# EAGLE schematic GDEnvSensorGW_1_15 (EAGLE 9.4.0)
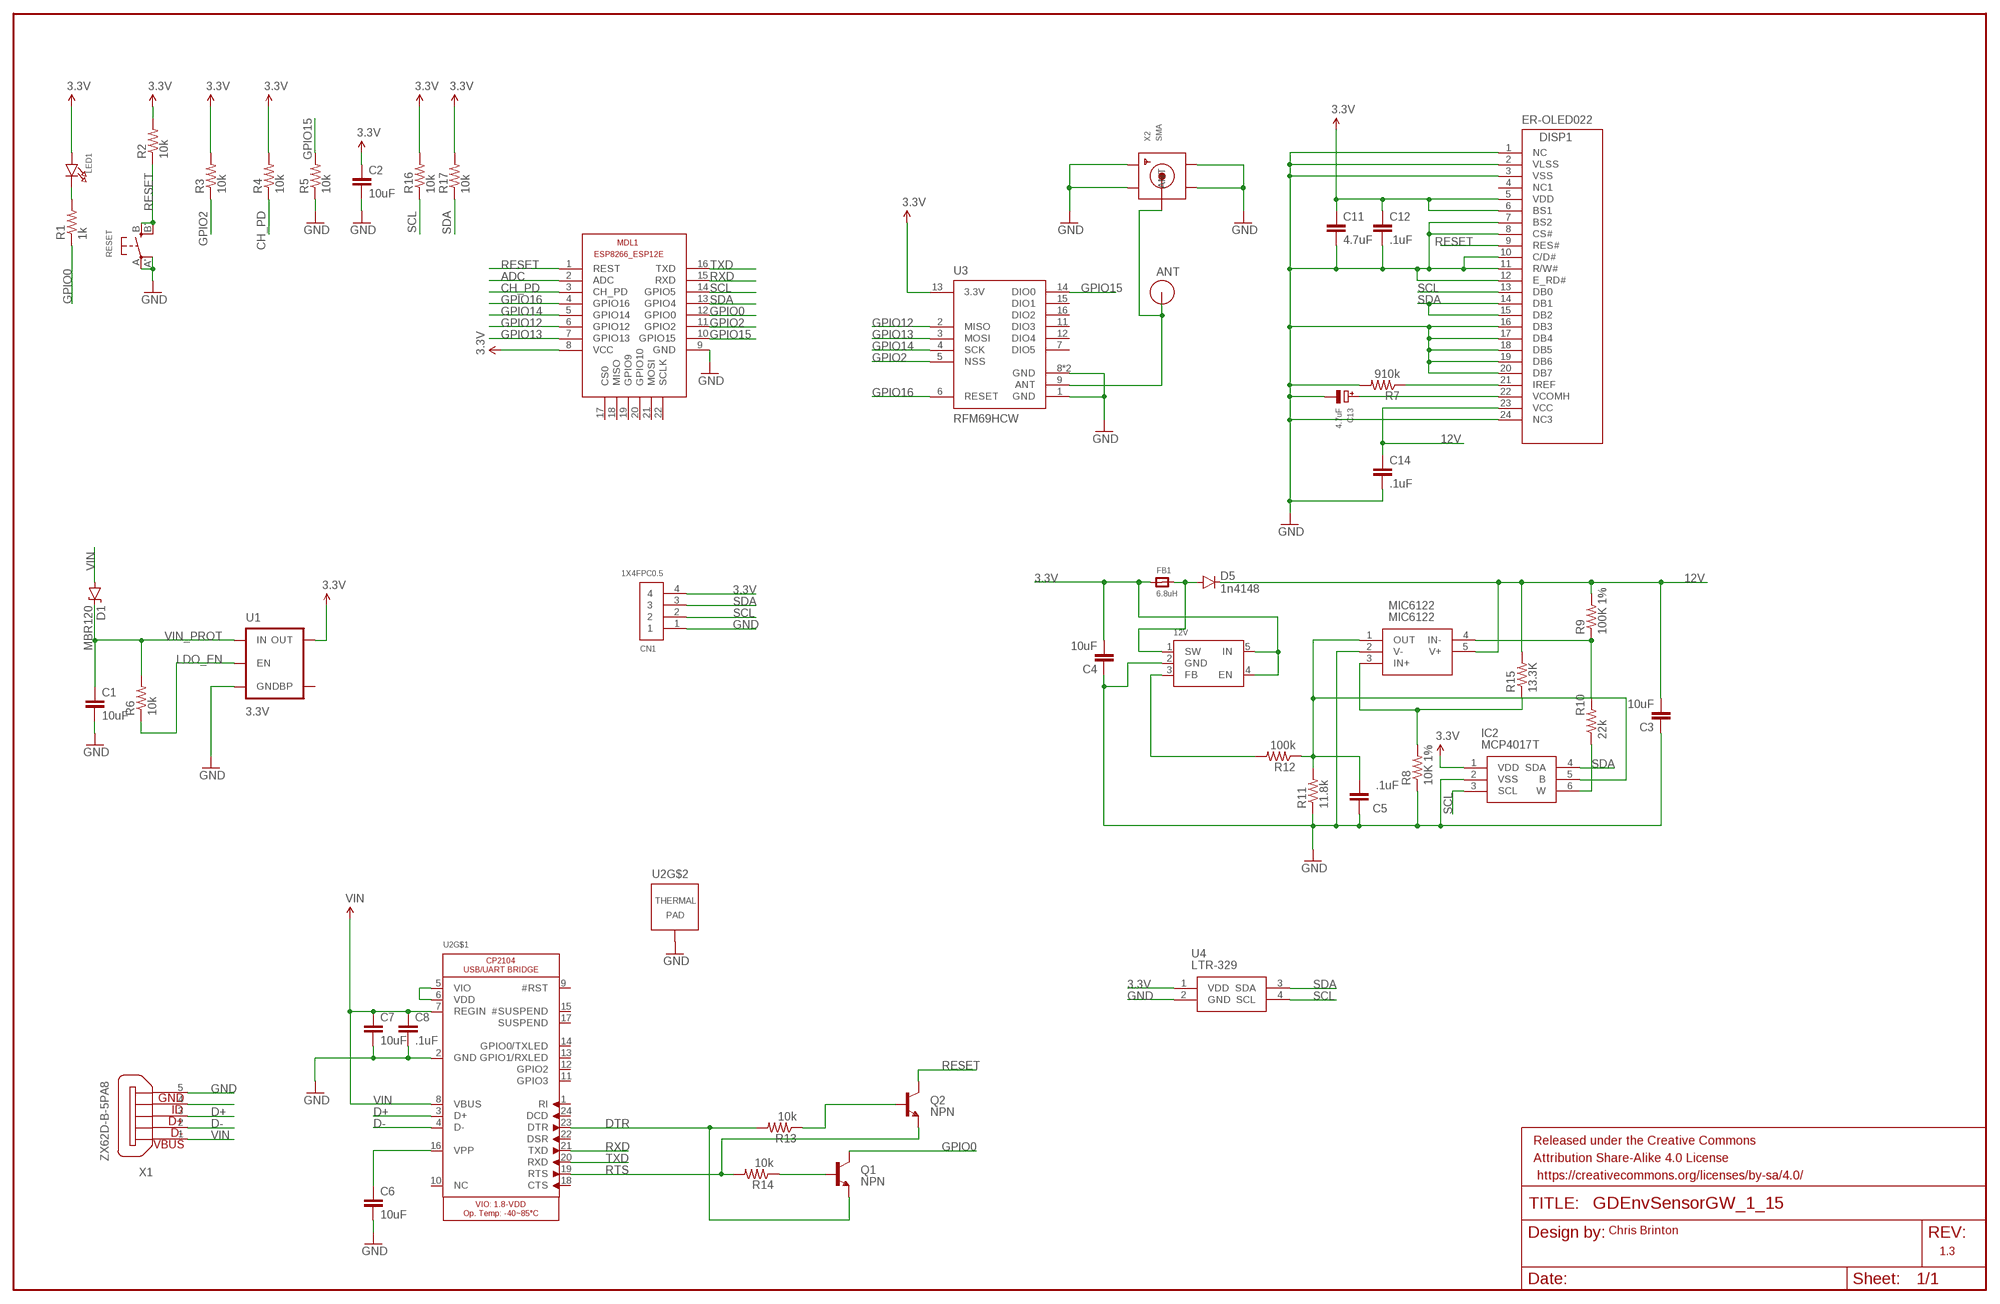
[diagram p0: schematic, sheet 1]

## Parts
12V  MP1541_SOT23-5  [SOT23-5]
ANT  RFM12B_ANTENNA  [RFM12B-ANTENNA]
C1  10uF  10UF10V10%(0805)  [0805-CAP]
C2  10uF  10UF10V10%(0805)  [0805-CAP]
C3  10uF  10UF10V10%(0805)  [0805-CAP]
C4  10uF  10UF10V10%(0805)  [0805-CAP]
C5  .1uF  10UF10V10%(0805)  [0805-CAP]
C6  10uF  10UF10V10%(0805)  [0805-CAP]
C7  10uF  10UF10V10%(0805)  [0805-CAP]
C8  .1uF  10UF10V10%(0805)  [0805-CAP]
C11  4.7uF  10UF10V10%(0805)  [0805-CAP]
C12  .1uF  10UF10V10%(0805)  [0805-CAP]
C13  4.7uF  CAP_TANTALUMA/3216_REFLOW  [EIA3216-18/A-R]
C14  .1uF  10UF10V10%(0805)  [0805-CAP]
CN1  1X4FPC0.5  [FPC_0.5MM-4]
D1  MBR120  DIODE-ZENER16V  [SOD-123]
D5  1n4148  DIODEBAS16  [SOD-323]
DISP1  ER-OLED022  [ER-OLED022]
FB1  6.8uH  FERRITE_0805  [_0805]
FRAME1  FRAME-LEDGER  [CREATIVE_COMMONS]
IC2  MCP4017T  MCP4017T-503E_LT  [SOT65P210X110-6N]
LED1  LED0805  [CHIPLED_0805]
MDL1  ESP8266-ESP12F  ESP8266-12EESP8266-ESP12E  [ESP8266-ESP12E]
MIC6122  MIC6122  MIC6211YM5-TR  [SOT95P280X145-5N]
Q1  NPN  TRANSISTOR_NPNMMBT2222A  [SOT23-3]
Q2  NPN  TRANSISTOR_NPNMMBT2222A  [SOT23-3]
R1  1k  R-US_R0805  [R0805]
R2  10k  R-US_R0805  [R0805]
R3  10k  R-US_R0805  [R0805]
R4  10k  R-US_R0805  [R0805]
R5  10k  R-US_R0805  [R0805]
R6  10k  R-US_R0805  [R0805]
R7  910k  R-US_R0805  [R0805]
R8  10K 1%  R-US_R0805  [R0805]
R9  100K 1%  R-US_R0805  [R0805]
R10  22k  R-US_R0805  [R0805]
R11  11.8k  R-US_R0805  [R0805]
R12  100k  R-US_R0805  [R0805]
R13  10k  R-US_R0805  [R0805]
R14  10k  R-US_R0805  [R0805]
R15  13.3K  R-US_R0805  [R0805]
R16  10k  R-US_R0805  [R0805]
R17  10k  R-US_R0805  [R0805]
RESET  SWITCH_TACT_SMT4.6X2.8  [BTN_KMR2_4.6X2.8]
U1  3.3V  V_REG_MIC52193.3V  [SOT23-5]
U2  CP2104  [QFN24_4MM_SMSC]
U3  RFM69HCW  [RFM69HCW-XXXS2]
U4  LTR-329  LTR-329ALS-01  [LTR329ALS01]
X1  ZX62D-B-5PA8  [ZX62D-B-5PA8]
X2  SMA  SMACONNECTOR_EDGE_UFL  [SMA_EDGELAUNCH_UFL]

## Nets
3.3V: 12V.4(EN) 12V.5(IN) C2.1 C4.2 C11.1 C12.1 CN1.4 DISP1.5(VDD) DISP1.6(BS1) FB1.1 IC2.1(VDD) LED1.A MDL1.8(VCC) R2.2 R3.2 R4.2 R16.2 R17.2 U1.5(OUT) U3.13(3.3V) U4.1(VDD)
12V: C3.2 C14.1 D5.C DISP1.23(VCC) MIC6122.5(V+) R9.2 R15.2
ADC: MDL1.2(ADC)
ANT: ANT.P$1 U3.9(ANT) X2.P(ANT)
CH_PD: MDL1.3(CH_PD) R4.1
D+: U2.3(D+) X1.3
D-: U2.4(D-) X1.2
DTR: Q1.2(E) R13.2 U2.23(DTR)
GND: 12V.2(GND) C1.2 C2.2 C3.1 C4.1 C5.1 C6.2 C7.2 C8.2 C11.2 C12.2 C13.- C14.2 CN1.1 DISP1.1(NC) DISP1.2(VLSS) DISP1.3(VSS) DISP1.7(BS2) DISP1.8(CS#) DISP1.10(C/D#) DISP1.11(R/W#) DISP1.12(E_RD#) DISP1.16(DB3) DISP1.17(DB4) DISP1.18(DB5) DISP1.19(DB6) DISP1.20(DB7) DISP1.24(NC3) IC2.2(VSS) MDL1.9(GND) MIC6122.2(V-) R5.1 R7.2 R8.1 R11.1 RESET.A'(P1) RESET.A(P) U1.2(GND) U2.2(GND) U2.THERM(TP) U3.1(GND) U3.8(GND) U3.10(GND) U4.2(GND) X1.5 X2.GND@1(GND1) X2.GND@2(GND2) X2.GND@3(GND3) X2.GND@4(GND4)
GPIO0: MDL1.12(GPIO0) Q1.3(C) R1.1
GPIO2: MDL1.11(GPIO2) R3.1 U3.5(NSS)
GPIO12: MDL1.6(GPIO12) U3.2(MISO)
GPIO13: MDL1.7(GPIO13) U3.3(MOSI)
GPIO14: MDL1.5(GPIO14) U3.4(SCK)
GPIO15: MDL1.10(GPIO15) R5.2 U3.14(DIO0)
GPIO16: MDL1.4(GPIO16) U3.6(RESET)
LDO_EN: R6.1 U1.3(EN)
N$1: U2.5(VIO) U2.6(VDD)
N$2: MIC6122.3(IN+) R8.2 R15.1
N$3: LED1.C R1.2
N$4: C13.+ DISP1.22(VCOMH)
N$5: C6.1 U2.16(VPP)
N$6: C5.2 IC2.5(B) MIC6122.1(OUT) R11.2 R12.1
N$7: MIC6122.4(IN-) R9.1 R10.2
N$8: 12V.1(SW) D5.A FB1.2
N$9: Q2.1(B) R13.1
N$11: DISP1.21(IREF) R7.1
N$12: IC2.6(W) R10.1
N$15: 12V.3(FB) R12.2
N$16: X1.4
N$17: Q1.1(B) R14.1
RESET: DISP1.9(RES#) MDL1.1(REST) Q2.3(C) R2.1 RESET.B'(S1) RESET.B(S)
RTS: Q2.2(E) R14.2 U2.19(RTS)
RXD: MDL1.15(RXD) U2.21(TXD)
SCL: CN1.2 DISP1.13(DB0) IC2.3(SCL) MDL1.14(GPIO5) R16.1 U4.4(SCL)
SDA: CN1.3 DISP1.14(DB1) DISP1.15(DB2) IC2.4(SDA) MDL1.13(GPIO4) R17.1 U4.3(SDA)
TXD: MDL1.16(TXD) U2.20(RXD)
VIN: C7.1 C8.1 D1.A U2.7(REGIN) U2.8(VBUS) X1.1
VIN_PROT: C1.1 D1.C R6.2 U1.1(IN)
Unconnected: DISP1.4(NC1) MDL1.17(CS0) MDL1.18(MISO) MDL1.19(GPIO9) MDL1.20(GPIO10) MDL1.21(MOSI) MDL1.22(SCLK) U1.4(BP) U2.1(RI) U2.9(#RST) U2.10(NC) U2.11(GPIO3) U2.12(GPIO2) U2.13(GPIO1/RXLED) U2.14(GPIO0/TXLED) U2.15(#SUSPEND) U2.17(SUSPEND) U2.18(CTS) U2.22(DSR) U2.24(DCD) U3.7(DIO5) U3.11(DIO3) U3.12(DIO4) U3.15(DIO1) U3.16(DIO2) X1.S1 X1.S2 X1.S3 X1.S4

## Notes on the sheet
- Chris Brinton
- 1.3

## Library data of the parts
12V = GDTech:MP1541_SOT23-5: SOT23-5 MP1541 Voltage Boost The MP1541 is a 5-pin thin SOT23 current mode step up converter intended for small, low power applications
ANT = LowPowerLab:RFM12B_ANTENNA; LABEL: ANT
C1-C8 C11 C12 C14 = SparkFun-Capacitors:10UF10V10%(0805): CAP-11330; PROD_ID: CAP-11330
C13 = microbuilder:CAP_TANTALUM: Tantalum Capacitors Wave footprints have larger pads and are meant to be used for hand soldering. Reflow footprints are optimised for solder paste and a reflow oven. EIA3216-18/A-[R/W] - Size A / 3216-18 / 1206 footprint 4.7µF 25V 10% Tantalum Capacitor 10µF 16V 10% Tantalum Capacitor [Digikey: 495-2236-2-ND] EIA3528-21/B-[R/W] - Size B / 3528-21 47µF 10V 10% Tantalum Capactior [Digikey: 495-2216-1-ND] EIA6032-28/C-[R/W] - Size C / 6032-28 10µF 35V 20% Tantalum Capacitor [Digikey: 495-2285-1-ND] 100µF 16V 10% Tantalum Capactior [Digikey: 399-5214-1-ND]
CN1 = adafruit:1X4: 4-pin connector
D1 = SparkFun-DiscreteSemi:DIODE-ZENER: Zener Diode Production Part - 8199 3.4V Zener Voltage; PROD_ID: DIO-12440; VALUE: 16V
D5 = SparkFun-DiscreteSemi:DIODE: Diode These are standard reverse protection diodes and small signal diodes. SMA package can handle up to about 1A. SOD-323 can handle about 200mA. What the SOD-323 package when ordering, there are some mfgs out there that are 5-pin packages.; PROD_ID: DIO-09646; VALUE: 250mA/100V
DISP1 = GDTech:ER-OLED022: East Rising 2.2" OLED display 128x32 24 pin .5mm pitch FPC connector
FB1 = microbuilder:FERRITE: Ferrite Bead 0603 MMZ1608B121C - 120 Ohm @ 100MHz, 600mA, 0.15 Ohm DC Resistance - Digikey: 445-2164-1-ND BK1608HW121-T - 120 Ohm, 600mA Ferrite Chip - Digikey: 587-1876-2-ND 0805 HZ0805B272R-10 - 2.7K Ohm @ 100MHz, 200mA, 0.8 Ohm DC Resistance - Digikey: 240-2504-1-ND (see also Murata BLM21BD272SN1L) MMZ2012Y152B - 1.5K Ohm @ 100MHz, 500mA, 0.4 Ohm DC Resistance - Digikey: 445-1560-1-ND - Mainly for high frequency (80-400MHz) MMZ2012R102A - 1K Ohm @ 100MHz, 500mA, 0.3 Ohm DC Resistance - Digikey: 445-1555-2-ND - More general purpose (10-200MHz)
FRAME1 = SparkFun-Aesthetics:FRAME-LEDGER: Schematic Frame Standard 11x14 US Ledger frame
IC2 = SamacSys_Parts:MCP4017T-503E_LT: Digital POT Source: Datasheet <http://componentsearchengine.com/Datasheets/3/MCP4017T-503E_LT.pdf>; ALLIED_NUMBER: 70388684; ALLIED_PRICE-STOCK: https://www.alliedelec.com/microchip-technology-inc-mcp4017t-503e-lt/70388684/; DESCRIPTION: Digital POT; HEIGHT: mm; MANUFACTURER_NAME: Microchip; MANUFACTURER_PART_NUMBER: MCP4017T-503E/LT; MOUSER_PART_NUMBER: 579-MCP4017T503E/LT; MOUSER_PRICE-STOCK: https://www.mouser.com/Search/Refine.aspx?Keyword=579-MCP4017T503E%2FLT; RS_PART_NUMBER: 7386796P; RS_PRICE-STOCK: http://uk.rs-online.com/web/p/products/7386796P
LED1 = microbuilder:LED: LED 0603 - 0603 Surface Mount Package 2mA: Green LED - Low Power (3.9mcd, 2ma, 1.7Vf) - Digikey: 475-2709-2-ND Orange LED - Low Power (9.8mcd, 2ma, 1.8Vf) - Digikey: 475-1194-2-ND Red LED - Low Power (5mcd, 2ma, 1.8Vf) - Digikey: 475-1195-2-ND Yellow LED - Low Power (7mcd, 2ma, 1.8Vf) - Digikey: 475-1196-2-ND 5mA: Blue LED - Low Power (17mcd, 5ma, 2.9Vf) - Digikey: LNJ937W8CRACT-ND 0805 - 0805 Surface Mount Package 2mA: Red LED (8.8mcd, 2mA, 1.8Vf, Clear) - Low Power [Digikey: 475-2510-1-ND] Green LED (5mcd, 2mA, 1.8Vf, Clear) - Low Power [Digikey: 475-2730-1-ND] Yellow LED (11.3mcd, 2mA, 1.8Vf, Clear) - Low Power [Digikey: 475-2555-1-ND] 20mA: Red LED (104mcd, 20mA, Diffused) - LS R976 [Digikey: 475-1278-6-ND] Red LED (12mcd, 20mA, 2.0Vf, Clear) - APT2012EC [Digikey: 754-1128-1-ND] Green LED (15mcd, 20mA, 2.2Vf, Clear) - APT2012GC [Digikey: 754-1131-1-ND] Orange LED (160mcd, 20mA, 2.1Vf, Clear) - APT2012SECK [Digikey: 754-1130-1-ND] 1206 - 1206 Surface Mount Package Green LED (26mcd, 20mA, Diffused) - LG N971 [Digikey: 475-1407-6-ND] Red LED (15mcd, 20mA, Diffused) - LH N974 [Digikey: 475-1416-6-ND]
MDL1 = ESP12E:ESP8266-12E: ESP8266-12E with additional I/O and GPIO04/05 corrected The author cannot warrant that this library is free from error or will meet your specific requirements. Created by PuceBaboon.com. Komagane, Nagano, JAPAN
MIC6122 = SamacSys_Parts:MIC6211YM5-TR: Operational Amplifiers - Op Amps Source: Datasheet <http://ww1.microchip.com/downloads/en/DeviceDoc/mic6211.pdf>; DESCRIPTION: Operational Amplifiers - Op Amps; HEIGHT: 1.45mm; MANUFACTURER_NAME: Micrel; MANUFACTURER_PART_NUMBER: MIC6211YM5-TR; MOUSER_PART_NUMBER: 998-MIC6211YM5TR; MOUSER_PRICE-STOCK: https://www.mouser.com/Search/Refine.aspx?Keyword=998-MIC6211YM5TR
Q1 Q2 = SparkFun-DiscreteSemi:TRANSISTOR_NPN: Generic NPN BJT MMBT2222A - TRANS-08049 (SOT-23, 1A 40V) MPSA42 - TRANS-09116 (SOT-23, 500mA 300V) MMBT5088LT1G - TRANS-11160 (SOT-23, 50 mA 30V) BC547 - COM-08928 <http://www.sparkfun.com/products/8928> (TO-92 45V 100mA) (1.Collector 2.Base 3.Emitter) 2N3904 - COM-00521 <http://www.sparkfun.com/products/521> (TO-92 40V 200mA) (1.Emitter 2.Base 3.Collector) P2N2222A - COM-12852 <http://www.sparkfun.com/products/12852> (TO-92 40V 600mA) (1.Collector 2.Base 3.Emitter); PROD_ID: TRANS-08049; VALUE: MMBT2222A
R1-R17 = adafruit:R-US_: RESISTOR, American symbol
RESET = microbuilder:SWITCH_TACT_SMT: SMT Tact Switches 6x6mm - Digikey: P12940SCT-ND KMR2 (4.6x2.8mm) - Digikey: 401-1426-1-ND EVQ-PQHB55 - Light Touch, 160GF (4.5x4.5mm) - Digikey: P8090SCT-ND
U1 = SparkFun-PowerIC:V_REG_MIC5219: V_REG MIC5219 Standard 3.3V and 5V 500mA LDO voltage regulator in SOT-23 layout. Micrel part MIC5219. BP (by-pass) pin is used to lower output noise with 470pF cap, may be left open.; PROD_ID: VREG-09872; VALUE: MIC5219 3.3V
U2 = GDTech:CP2104: CP2104 - USB to UART Bridge VDD Output: 3.45V
U3 = SparkFun-RF:RFM69H; PROD_ID: IC-11997, IC-12053
U4 = SamacSys_Parts:LTR-329ALS-01: Ambient Light Sensors Ambient Light Photo Sensor Source: Datasheet <http://www.mouser.com/ds/2/239/liteon_LTR-329ALS-01-1175539.pdf>; DESCRIPTION: Ambient Light Sensors Ambient Light Photo Sensor; HEIGHT: 0mm; MANUFACTURER_NAME: Lite-On; MANUFACTURER_PART_NUMBER: LTR-329ALS-01; MOUSER_PART_NUMBER: 859-LTR-329ALS-01; MOUSER_PRICE-STOCK: https://www.mouser.com/Search/Refine.aspx?Keyword=859-LTR-329ALS-01
X1 = GDTech:ZX62D-B-5PA8: Micro USB Type B Connector - Standard, Shell Through Hole Source: http://www.hirose.co.jp/cataloge_hp/ed_ZX_20140804.pdf; MF: Hirose; MPN: ZX62D-B-5PA8; OC_FARNELL: 2300438; OC_NEWARK: 69W0712
X2 = adafruit:SMACONNECTOR: SMA Connector 90° DIP SMA Connector, 50 Ohm (4UConnector: 07259)